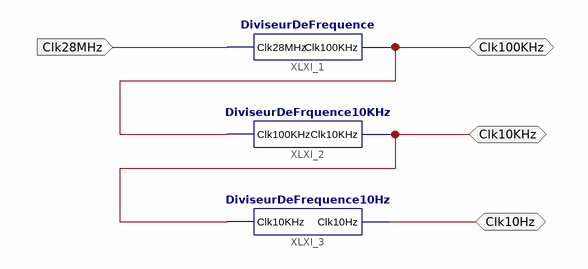
[diagram p0: schematic sheet 1]
// Xilinx ISE schematic DiviseurFrequence.sch (spartan3a) as structural Verilog: 3 symbols, 4 ports
module DiviseurFrequence (
  input  Clk28MHz,
  inout  Clk10KHz,
  inout  Clk10Hz,
  inout  Clk100KHz
);

  DiviseurDeFrquence10KHz XLXI_2 (.Clk100KHz(Clk100KHz), .Clk10KHz(Clk10KHz));
  DiviseurDeFrequence10Hz XLXI_3 (.Clk10KHz(Clk10KHz), .Clk10Hz(Clk10Hz));
  DiviseurDeFrequence XLXI_1 (.Clk28MHz(Clk28MHz), .Clk100KHz(Clk100KHz));
endmodule
